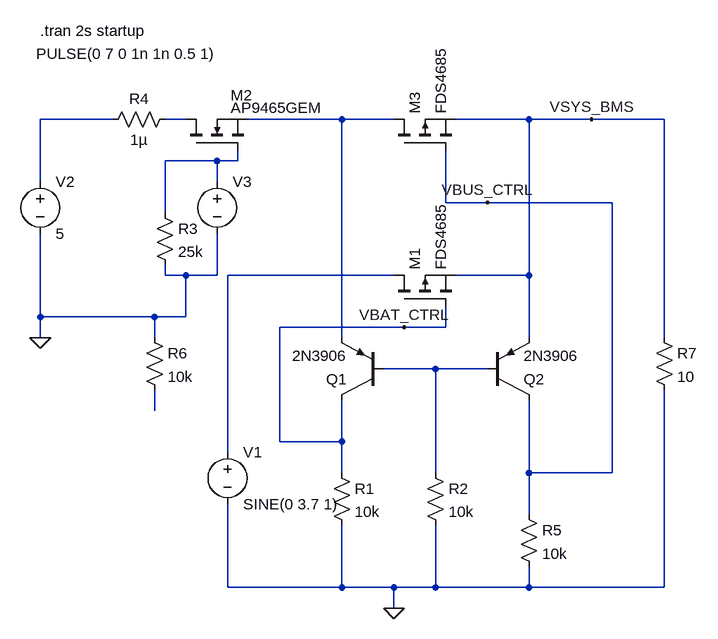
[diagram p0: schematic Auto-Power_Switch.asc]
Auto-Power_Switch.asc, the LTspice schematic file:
Version 4
SHEET 1 1116 992
WIRE 192 224 80 224
WIRE 304 224 272 224
WIRE 544 224 400 224
WIRE 624 224 544 224
WIRE 832 224 720 224
WIRE 928 224 832 224
WIRE 1040 224 928 224
WIRE 352 288 272 288
WIRE 384 288 384 272
WIRE 384 288 352 288
WIRE 80 320 80 224
WIRE 352 320 352 288
WIRE 704 352 704 272
WIRE 768 352 704 352
WIRE 960 352 768 352
WIRE 272 368 272 288
WIRE 272 464 272 448
WIRE 304 464 272 464
WIRE 352 464 352 400
WIRE 352 464 304 464
WIRE 624 464 368 464
WIRE 832 464 832 224
WIRE 832 464 720 464
WIRE 80 528 80 400
WIRE 256 528 80 528
WIRE 304 528 304 464
WIRE 304 528 256 528
WIRE 640 544 448 544
WIRE 704 544 704 512
WIRE 704 544 640 544
WIRE 80 560 80 528
WIRE 256 560 256 528
WIRE 544 560 544 224
WIRE 832 560 832 464
WIRE 1040 560 1040 224
WIRE 688 608 608 608
WIRE 768 608 688 608
WIRE 256 672 256 640
WIRE 448 720 448 544
WIRE 544 720 544 656
WIRE 544 720 448 720
WIRE 368 736 368 464
WIRE 544 768 544 720
WIRE 688 768 688 608
WIRE 832 768 832 656
WIRE 960 768 960 352
WIRE 960 768 832 768
WIRE 832 832 832 768
WIRE 368 944 368 816
WIRE 544 944 544 848
WIRE 544 944 368 944
WIRE 624 944 544 944
WIRE 688 944 688 848
WIRE 688 944 624 944
WIRE 832 944 832 912
WIRE 832 944 688 944
WIRE 1040 944 1040 640
WIRE 1040 944 832 944
WIRE 624 976 624 944
FLAG 80 560 0
FLAG 624 976 0
FLAG 640 544 VBAT_CTRL
FLAG 768 352 VBUS_CTRL
FLAG 928 224 VSYS_BMS
SYMBOL voltage 368 720 R0
WINDOW 123 0 0 Left 0
WINDOW 39 0 0 Left 0
SYMATTR InstName V1
SYMATTR Value SINE(0 3.7 1)
SYMBOL voltage 80 304 R0
WINDOW 123 0 0 Left 0
WINDOW 39 0 0 Left 0
SYMATTR InstName V2
SYMATTR Value 5
SYMBOL nmos 304 272 R270
WINDOW 0 85 69 VRight 2
WINDOW 3 66 69 VRight 2
SYMATTR InstName M2
SYMATTR Value AP9465GEM
SYMBOL voltage 352 304 R0
WINDOW 3 -278 -181 Left 2
WINDOW 123 0 0 Left 0
WINDOW 39 0 0 Left 0
SYMATTR Value PULSE(0 7 0 1n 1n 0.5 1)
SYMATTR InstName V3
SYMBOL res 256 352 R0
SYMATTR InstName R3
SYMATTR Value 25k
SYMBOL res 176 240 R270
WINDOW 0 32 56 VTop 2
WINDOW 3 0 56 VBottom 2
SYMATTR InstName R4
SYMATTR Value 1µ
SYMBOL pnp 608 656 R180
SYMATTR InstName Q1
SYMATTR Value 2N3906
SYMBOL pnp 768 656 M180
SYMATTR InstName Q2
SYMATTR Value 2N3906
SYMBOL res 528 752 R0
SYMATTR InstName R1
SYMATTR Value 10k
SYMBOL res 672 752 R0
SYMATTR InstName R2
SYMATTR Value 10k
SYMBOL res 816 816 R0
SYMATTR InstName R5
SYMATTR Value 10k
SYMBOL pmos 624 272 R270
SYMATTR InstName M3
SYMATTR Value FDS4685
SYMBOL pmos 624 512 R270
SYMATTR InstName M1
SYMATTR Value FDS4685
SYMBOL res 240 544 R0
SYMATTR InstName R6
SYMATTR Value 10k
SYMBOL res 1024 544 R0
SYMATTR InstName R7
SYMATTR Value 10
TEXT 80 88 Left 2 !.tran 2s startup

The netlist it stands for:
* Auto-Power_Switch.asc
V1 N005 0 SINE(0 3.7 1)
V2 N001 0 5
M2 N002 N004 N003 N003 AP9465GEM
V3 N004 0 PULSE(0 7 0 1n 1n 0.5 1)
R3 N004 0 25k
R4 N001 N002 1µ
Q1 VBAT_CTRL N006 N003 0 2N3906
Q2 VBUS_CTRL N006 VSYS_BMS 0 2N3906
R1 VBAT_CTRL 0 10k
R2 N006 0 10k
R5 VBUS_CTRL 0 10k
M3 N003 VBUS_CTRL VSYS_BMS VSYS_BMS FDS4685
M1 N005 VBAT_CTRL VSYS_BMS VSYS_BMS FDS4685
R6 0 N007 10k
R7 VSYS_BMS 0 10
.model NPN NPN
.model PNP PNP
.lib standard.bjt
.model NMOS NMOS
.model PMOS PMOS
.lib standard.mos
.tran 2s startup
.backanno
.end